# Altium schematic sheet 01_Power_Control.SchDoc: POWER AND CONTROL
size A4; Author: Henrique Rosa; DrawnBy: Henq / Codex; Engineer: Henrique Rosa; Address1: rua; Address: Bairro; Address3: São Paulo, SP - Brasil; Address4: 55 (11) 9 6825-6715; DocumentNumber: GBS-01; Revision: 1.0; SheetNumber: 02; SheetTotal: 06; Site: henq.com; VersionControl_RevNumber: 03; PageSetup: Record=PageOptions|CenterHorizontal=True|CenterVertical=True|PrintScale=0.98|XCorrection=1.00|YCorrection=1.00|PrintKind=0|BorderSize=5000000|LeftOffset=0|BottomOffset=0|Orientation=2|PaperLength=1000|PaperWidth=1000|Scale=100|PaperSource=7|PrintQuality=-3|MediaType=1|DitherType=10|PrintScaleMode=1|PaperKind=A4|PaperIndex=9
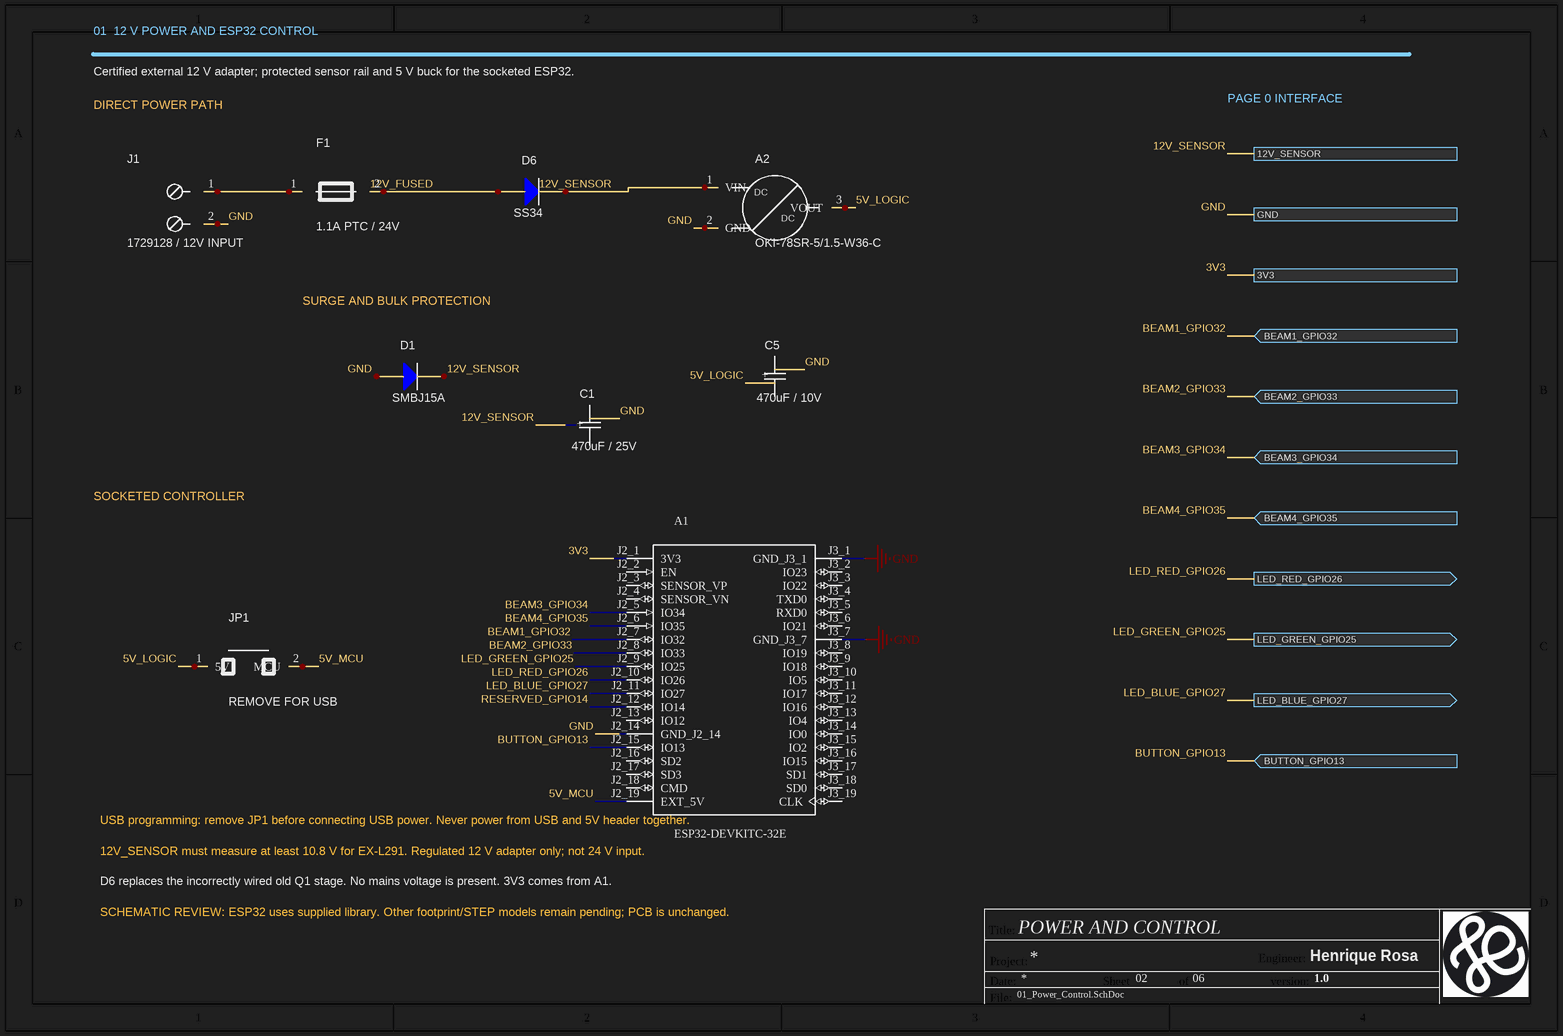
[diagram p0: 01_Power_Control.SchDoc]

## Parts
A1  ESP32-DEVKITC-32E  [MODULE_ESP32-DEVKITC-32E]
A2  OKI-78SR-5/1.5-W36-C  [MURATA_OKI78SR_VERTICAL]
C1  470uF / 25V  [PANASONIC_EEUFR1E471_D10_P5]
C5  470uF / 10V  [PANASONIC_EEUFR1A471_D8_P3_5]
D1  SMBJ15A  [SMBJ15A_A1_K2]
D6  SS34  [SS34_A1_K2]
F1  1.1A PTC / 24V  [BOURNS_MFMSMF110_24X_STYLE2]
J1  1729128 / 12V INPUT  [PHOENIX_1729128_MKDSN_2_508]
JP1  REMOVE FOR USB  [SAMTEC_TSW102_07_SINGLE]

## Ports
3V3, 12V_SENSOR, BEAM1_GPIO32 (in), BEAM2_GPIO33 (in), BEAM3_GPIO34 (in), BEAM4_GPIO35 (in), BUTTON_GPIO13 (in), GND, LED_BLUE_GPIO27 (out), LED_GREEN_GPIO25 (out), LED_RED_GPIO26 (out)

## Nets
GND: A1.J2_14(GND_J2_14) A1.J3_1(GND_J3_1) A1.J3_7(GND_J3_7) A2.2(GND) D1.1(A) J1.2(0V) ; port GND
3V3: A1.J2_1(3V3) ; port 3V3
5V_LOGIC: A2.3(VOUT) JP1.1(5V)
5V_MCU: A1.J2_19(EXT_5V) JP1.2(MCU)
12V_FUSED: D6.1(A) F1.2
12V_SENSOR: A2.1(VIN) D1.2(K) D6.2(K) ; port 12V_SENSOR
BEAM1_GPIO32: A1.J2_7(IO32) ; port BEAM1_GPIO32
BEAM2_GPIO33: A1.J2_8(IO33) ; port BEAM2_GPIO33
BEAM3_GPIO34: A1.J2_5(IO34) ; port BEAM3_GPIO34
BEAM4_GPIO35: A1.J2_6(IO35) ; port BEAM4_GPIO35
BUTTON_GPIO13: A1.J2_15(IO13) ; port BUTTON_GPIO13
LED_BLUE_GPIO27: A1.J2_11(IO27) ; port LED_BLUE_GPIO27
LED_GREEN_GPIO25: A1.J2_9(IO25) ; port LED_GREEN_GPIO25
LED_RED_GPIO26: A1.J2_10(IO26) ; port LED_RED_GPIO26
RESERVED_GPIO14: A1.J2_12(IO14)
NetF1_1: F1.1 J1.1(+12V)

Not connected (* = marked no-connect by the designer): A1 J2_2(EN) J2_3(SENSOR_VP) J2_4(SENSOR_VN) J2_13(IO12) J2_16(SD2) J2_17(SD3) J2_18(CMD) J3_2(IO23) J3_3(IO22) J3_4(TXD0) J3_5(RXD0) J3_6(IO21) J3_8(IO19) J3_9(IO18) J3_10(IO5) J3_11(IO17) J3_12(IO16) J3_13(IO4) J3_14(IO0) J3_15(IO2) J3_16(IO15) J3_17(SD1) J3_18(SD0) J3_19(CLK); C1 1 2; C5 1 2

## Notes on the sheet
- 01  12 V POWER AND ESP32 CONTROL
- Certified external 12 V adapter; protected sensor rail and 5 V buck for the socketed ESP32.
- DIRECT POWER PATH
- PAGE 0 INTERFACE
- SURGE AND BULK PROTECTION
- SOCKETED CONTROLLER
- (near A1) USB programming: remove JP1 before connecting USB power. Never power from USB and 5V header together.
- (near A1) 12V_SENSOR must measure at least 10.8 V for EX-L291. Regulated 12 V adapter only; not 24 V input.
- D6 replaces the incorrectly wired old Q1 stage. No mains voltage is present. 3V3 comes from A1.
- SCHEMATIC REVIEW: ESP32 uses supplied library. Other footprint/STEP models remain pending; PCB is unchanged.
- Title:
- Project:
- Date:
- Sheet
- of
- Engineer:
- version:
- File:
- Title
- Size:
- A4
- Number:
- Time:
- Revision:
- (in symbol *) DC
- (in symbol Capacitor Cerâmico SMD) +

## Library data of the parts
A1 = ESP32-DEVKITC-32E: The ESP32-DEVKITC-32E transceiver evaluation board from Espressif Systems is a powerful development tool for wireless communication technologies. It supports 802.11 b/g/n Wi-Fi and BluetoothÂ® Smart Ready 4.x (BLE) dual-mode at 2.4GHz, making it ideal for; CAD status: Supplied SnapMagic symbol and linked native footprint; SnapEDA_Link: https://www.snapeda.com/parts/ESP32-DEVKITC-32E/Espressif+Systems/view-part/?ref=snap; Package: None; Value: *; MF: Espressif Systems; MP: ESP32-DEVKITC-32E; Check_prices: https://www.snapeda.com/parts/ESP32-DEVKITC-32E/Espressif+Systems/view-part/?ref=eda; Manufacturer: Espressif Systems; Manufacturer Part Number: ESP32-DevKitC-32E
A2 = *: 12 V to regulated 5 V DC/DC module; Manufacturer: Murata; Populate: Yes; CAD status: Native module symbol; verified 1 VIN / 2 GND / 3 VOUT; embedded community STEP, registration pending; Symbol provenance: Project-authored native Altium library; based on identified manufacturer part and pinout, not vendor-issued CAD; Manufacturer Part Number: OKI-78SR-5/1.5-W36-C; Package: SIP3_BUCK; Intended footprint: MURATA_OKI78SR_VERTICAL; Datasheet: https://www.murata.com/products/productdata/8807037992990/oki-78sr.pdf
C1 = Capacitor Cerâmico SMD: Protected 12 V bulk capacitor; Manufacturer: Panasonic; Valor: 100nF; cod.: 186030; Symbol source: Conventional symbol reused from ENERGY.SchDoc; CAD status: Pin link repaired; placement/routing/DRC not released; Polarity: Pin 1 positive; pin 2 negative; Manufacturer Part Number: EEU-FR1E471; Intended footprint: PANASONIC_EEUFR1E471_D10_P5; Footprint source: Local PinRepairFootprints.PcbLib; source and polarity checked
C5 = Capacitor Cerâmico SMD: ESP32 Wi-Fi peak-current reservoir; Manufacturer: Panasonic; Valor: 100nF; cod.: 186030; Symbol source: Conventional symbol reused from ENERGY.SchDoc; CAD status: Pin link repaired; placement/routing/DRC not released; Polarity: Pin 1 positive; pin 2 negative; Manufacturer Part Number: EEU-FR1A471; Intended footprint: PANASONIC_EEUFR1A471_D8_P3_5; Footprint source: Local PinRepairFootprints.PcbLib; source and polarity checked
D1 = Diode: 15 V TVS suppressor - cathode to positive rail; Part Number: FDLL4148; Manufacturer: Littelfuse; Symbol source: Conventional symbol reused from ENERGY.SchDoc; CAD status: Pin link repaired; placement/routing/DRC not released; LatestRevisionDate: 17-Jul-2002; LatestRevisionNote: Re-released for DXP Platform.; PackageDocument: Sep-1996; PackageReference: SMC; Code_JEDEC: DO-214-AB; Value: value; Manufacturer Part Number: SMBJ15A; Intended footprint: SMBJ15A_A1_K2; Footprint source: Local PinRepairFootprints.PcbLib; source and polarity checked
D6 = Diode: Series reverse-polarity Schottky diode; Part Number: FDLL4148; Manufacturer: Vishay; Symbol source: Conventional symbol reused from ENERGY.SchDoc; CAD status: Pin link repaired; placement/routing/DRC not released; LatestRevisionDate: 17-Jul-2002; LatestRevisionNote: Re-released for DXP Platform.; PackageDocument: Sep-1996; PackageReference: SMC; Code_JEDEC: DO-214-AB; Value: value; Manufacturer Part Number: SS34-E3/57T; Intended footprint: SS34_A1_K2; Footprint source: Local PinRepairFootprints.PcbLib; source and polarity checked
F1 = *: Resettable 12 V input fuse; Manufacturer: Bourns; Populate: Yes; CAD status: Pin link repaired; placement/routing/DRC not released; Manufacturer Part Number: MF-MSMF110/24X-2; Package: F1812; Intended footprint: BOURNS_MFMSMF110_24X_STYLE2; Footprint source: Local PinRepairFootprints.PcbLib; source and polarity checked; Part Number: MF-MSMF110/24X-2; Voltage rating: 24 V
J1 = *: Two-position 5.08 mm screw terminal; Manufacturer: Phoenix Contact; Populate: Yes; CAD status: Native screw-terminal symbol and explicit pad mapping; verify footprint/body before production; Symbol provenance: Project-authored native Altium library; based on identified manufacturer part and pinout, not vendor-issued CAD; Manufacturer Part Number: 1729128; Package: TERM_2_508; Intended footprint: PHOENIX_1729128_MKDSN_2_508
JP1 = *: External 5 V disconnect; fit shunt only without USB; Manufacturer: Samtec; Populate: Yes; CAD status: Pin link repaired; placement/routing/DRC not released; Manufacturer Part Number: TSW-102-07-G-S; Package: HEADER_1X02_2.54; Intended footprint: SAMTEC_TSW102_07_SINGLE; Footprint source: Local PinRepairFootprints.PcbLib; source and polarity checked